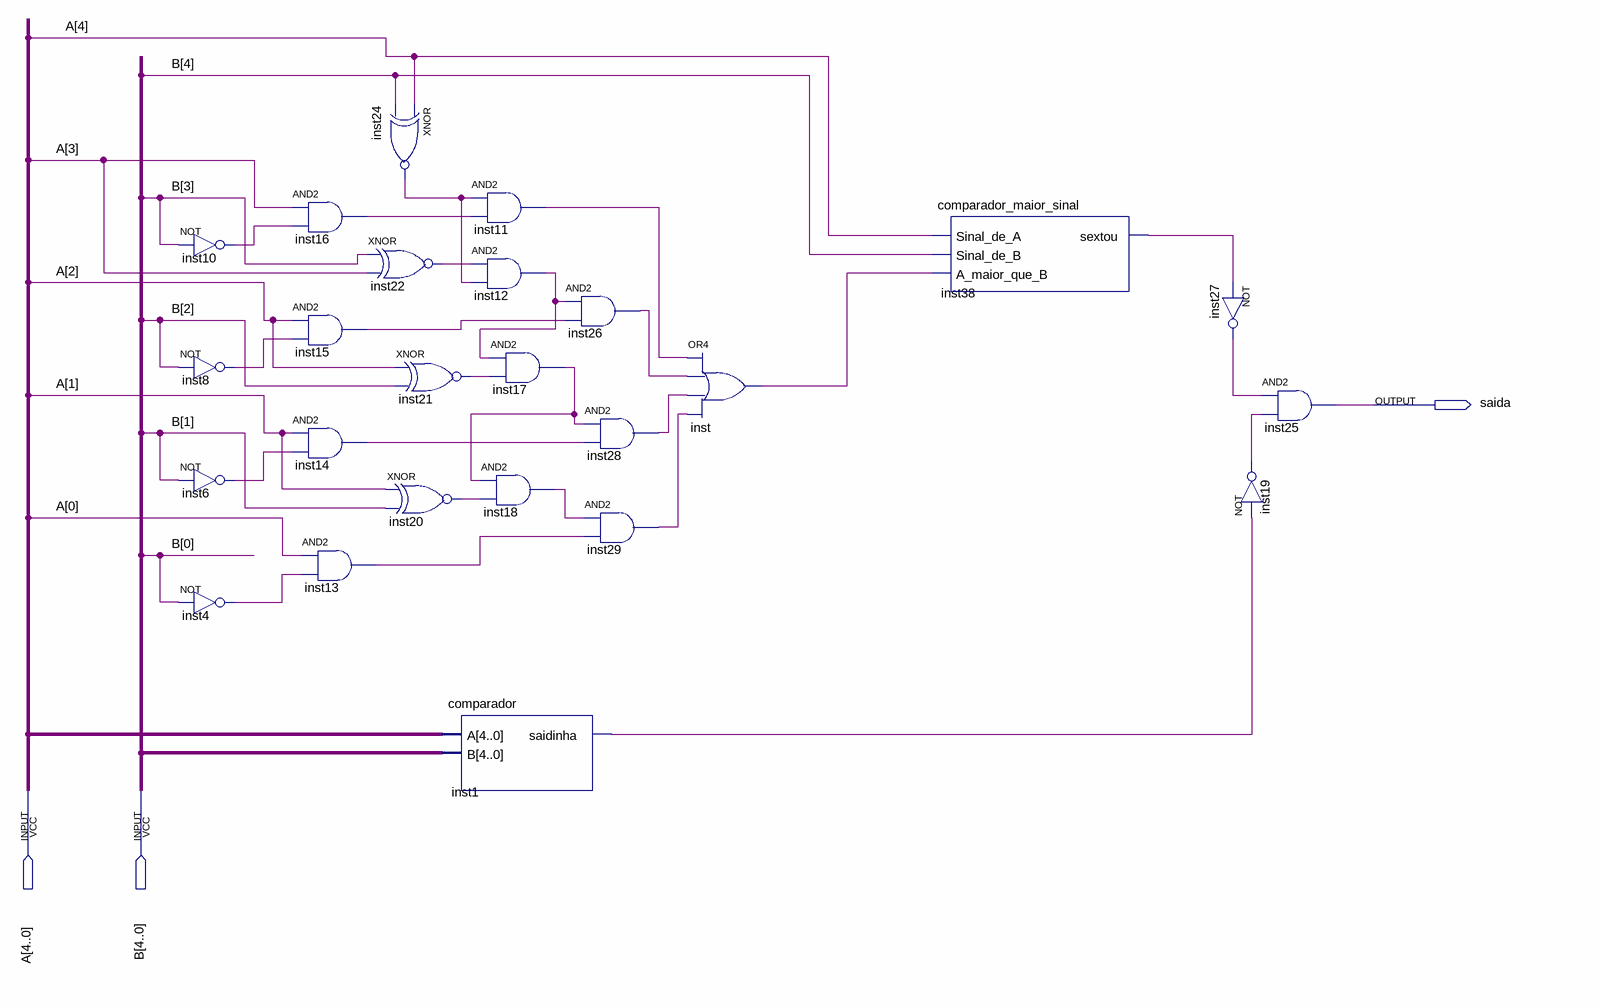
[diagram p0: schematic sheet]
// Quartus schematic comparador_menorque.bdf as structural Verilog: 25 symbols, 3 pins
module comparador_menorque (
  input  [4:0] A,
  input  [4:0] B,
  output saida
);

  wire inst1_saidinha, inst4_out, inst6_out, inst8_out, inst10_out, inst11_out, inst12_out, inst13_out,
       inst14_out, inst15_out, inst16_out, inst17_out, inst18_out, inst19_out, inst20_out, inst21_out,
       inst22_out, inst24_out, inst26_out, inst27_out, inst28_out, inst29_out, inst38_sextou, inst_out;

  not inst10 (inst10_out, B[3]);
  not inst8 (inst8_out, B[2]);
  not inst6 (inst6_out, B[1]);
  not inst4 (inst4_out, B[0]);
  and inst16 (inst16_out, A[3], inst10_out);
  and inst15 (inst15_out, A[2], inst8_out);
  and inst14 (inst14_out, A[1], inst6_out);
  and inst13 (inst13_out, A[0], inst4_out);
  xnor inst24 (inst24_out, A[4], B[4]);
  xnor inst22 (inst22_out, B[3], A[3]);
  xnor inst21 (inst21_out, A[2], B[2]);
  xnor inst20 (inst20_out, A[1], B[1]);
  and inst11 (inst11_out, inst24_out, inst16_out);
  and inst12 (inst12_out, inst22_out, inst24_out);
  and inst17 (inst17_out, inst12_out, inst21_out);
  and inst18 (inst18_out, inst17_out, inst20_out);
  comparador inst1 (.A(A), .B(B), .saidinha(inst1_saidinha));
  and inst26 (inst26_out, inst12_out, inst15_out);
  and inst28 (inst28_out, inst17_out, inst14_out);
  and inst29 (inst29_out, inst18_out, inst13_out);
  or inst (inst_out, inst11_out, inst26_out, inst28_out, inst29_out);
  comparador_maior_sinal inst38 (
    .Sinal_de_A(A[4]), .Sinal_de_B(B[4]), .A_maior_que_B(inst_out), .sextou(inst38_sextou));
  not inst27 (inst27_out, inst38_sextou);
  not inst19 (inst19_out, inst1_saidinha);
  and inst25 (saida, inst27_out, inst19_out);
endmodule
